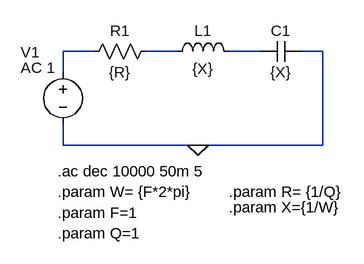
[diagram p0: schematic Circuito RLC (Serie).asc]
Circuito RLC (Serie).asc, the LTspice schematic file:
Version 4
SHEET 1 880 680
WIRE 112 80 64 80
WIRE 240 80 192 80
WIRE 368 80 320 80
WIRE 464 80 432 80
WIRE 64 112 64 80
WIRE 64 224 64 192
WIRE 272 224 64 224
WIRE 464 224 464 80
WIRE 464 224 272 224
FLAG 272 224 0
SYMBOL voltage 64 96 R0
WINDOW 123 -65 9 Left 2
WINDOW 39 0 0 Left 0
WINDOW 0 -65 -15 Left 2
SYMATTR Value2 AC 1
SYMATTR InstName V1
SYMATTR Value ""
SYMBOL res 208 64 R90
WINDOW 0 0 56 VBottom 2
WINDOW 3 32 56 VTop 2
SYMATTR InstName R1
SYMATTR Value {R}
SYMBOL ind 224 96 R270
WINDOW 0 32 56 VTop 2
WINDOW 3 5 56 VBottom 2
SYMATTR InstName L1
SYMATTR Value {X}
SYMBOL cap 432 64 R90
WINDOW 0 0 32 VBottom 2
WINDOW 3 32 32 VTop 2
SYMATTR InstName C1
SYMATTR Value {X}
TEXT 56 328 Left 2 !.param F=1
TEXT 56 360 Left 2 !.param Q=1
TEXT 320 320 Left 2 !.param X={1/W}
TEXT 320 296 Left 2 !.param R= {1/Q}
TEXT 56 264 Left 2 !.ac dec 10000 50m 5
TEXT 56 296 Left 2 !.param W= {F*2*pi}

The netlist it stands for:
* Circuito RLC (Serie).asc
V1 N001 0 AC 1
R1 N002 N001 {R}
L1 N002 N003 {X}
C1 0 N003 {X}
.param F=1
.param Q=1
.param X={1/W}
.param R= {1/Q}
.ac dec 10000 50m 5
.param W= {F*2*pi}
.backanno
.end